# Altium schematic sheet SPE_router_pwr.SchDoc: SPE Router
size 420 x 297 mm; Author: P. Daniel; CompanyName: WUT ISE; DrawnBy: P. Daniel; Organization: WUT ISE; Address1: WUT ISE; Address2: Nowowiejska 15/19 00-665 Warsaw; Address3: piotrmaciejdaniel@gmail.com; Revision: 1; SheetNumber: 2; SheetTotal: 4; ModifiedBy: -; CreateDate: 02-03.2023; CheckedDate: -; Title2: PoE power supply; DivGrp: WUT ISE; Designer: Piotr Daniel
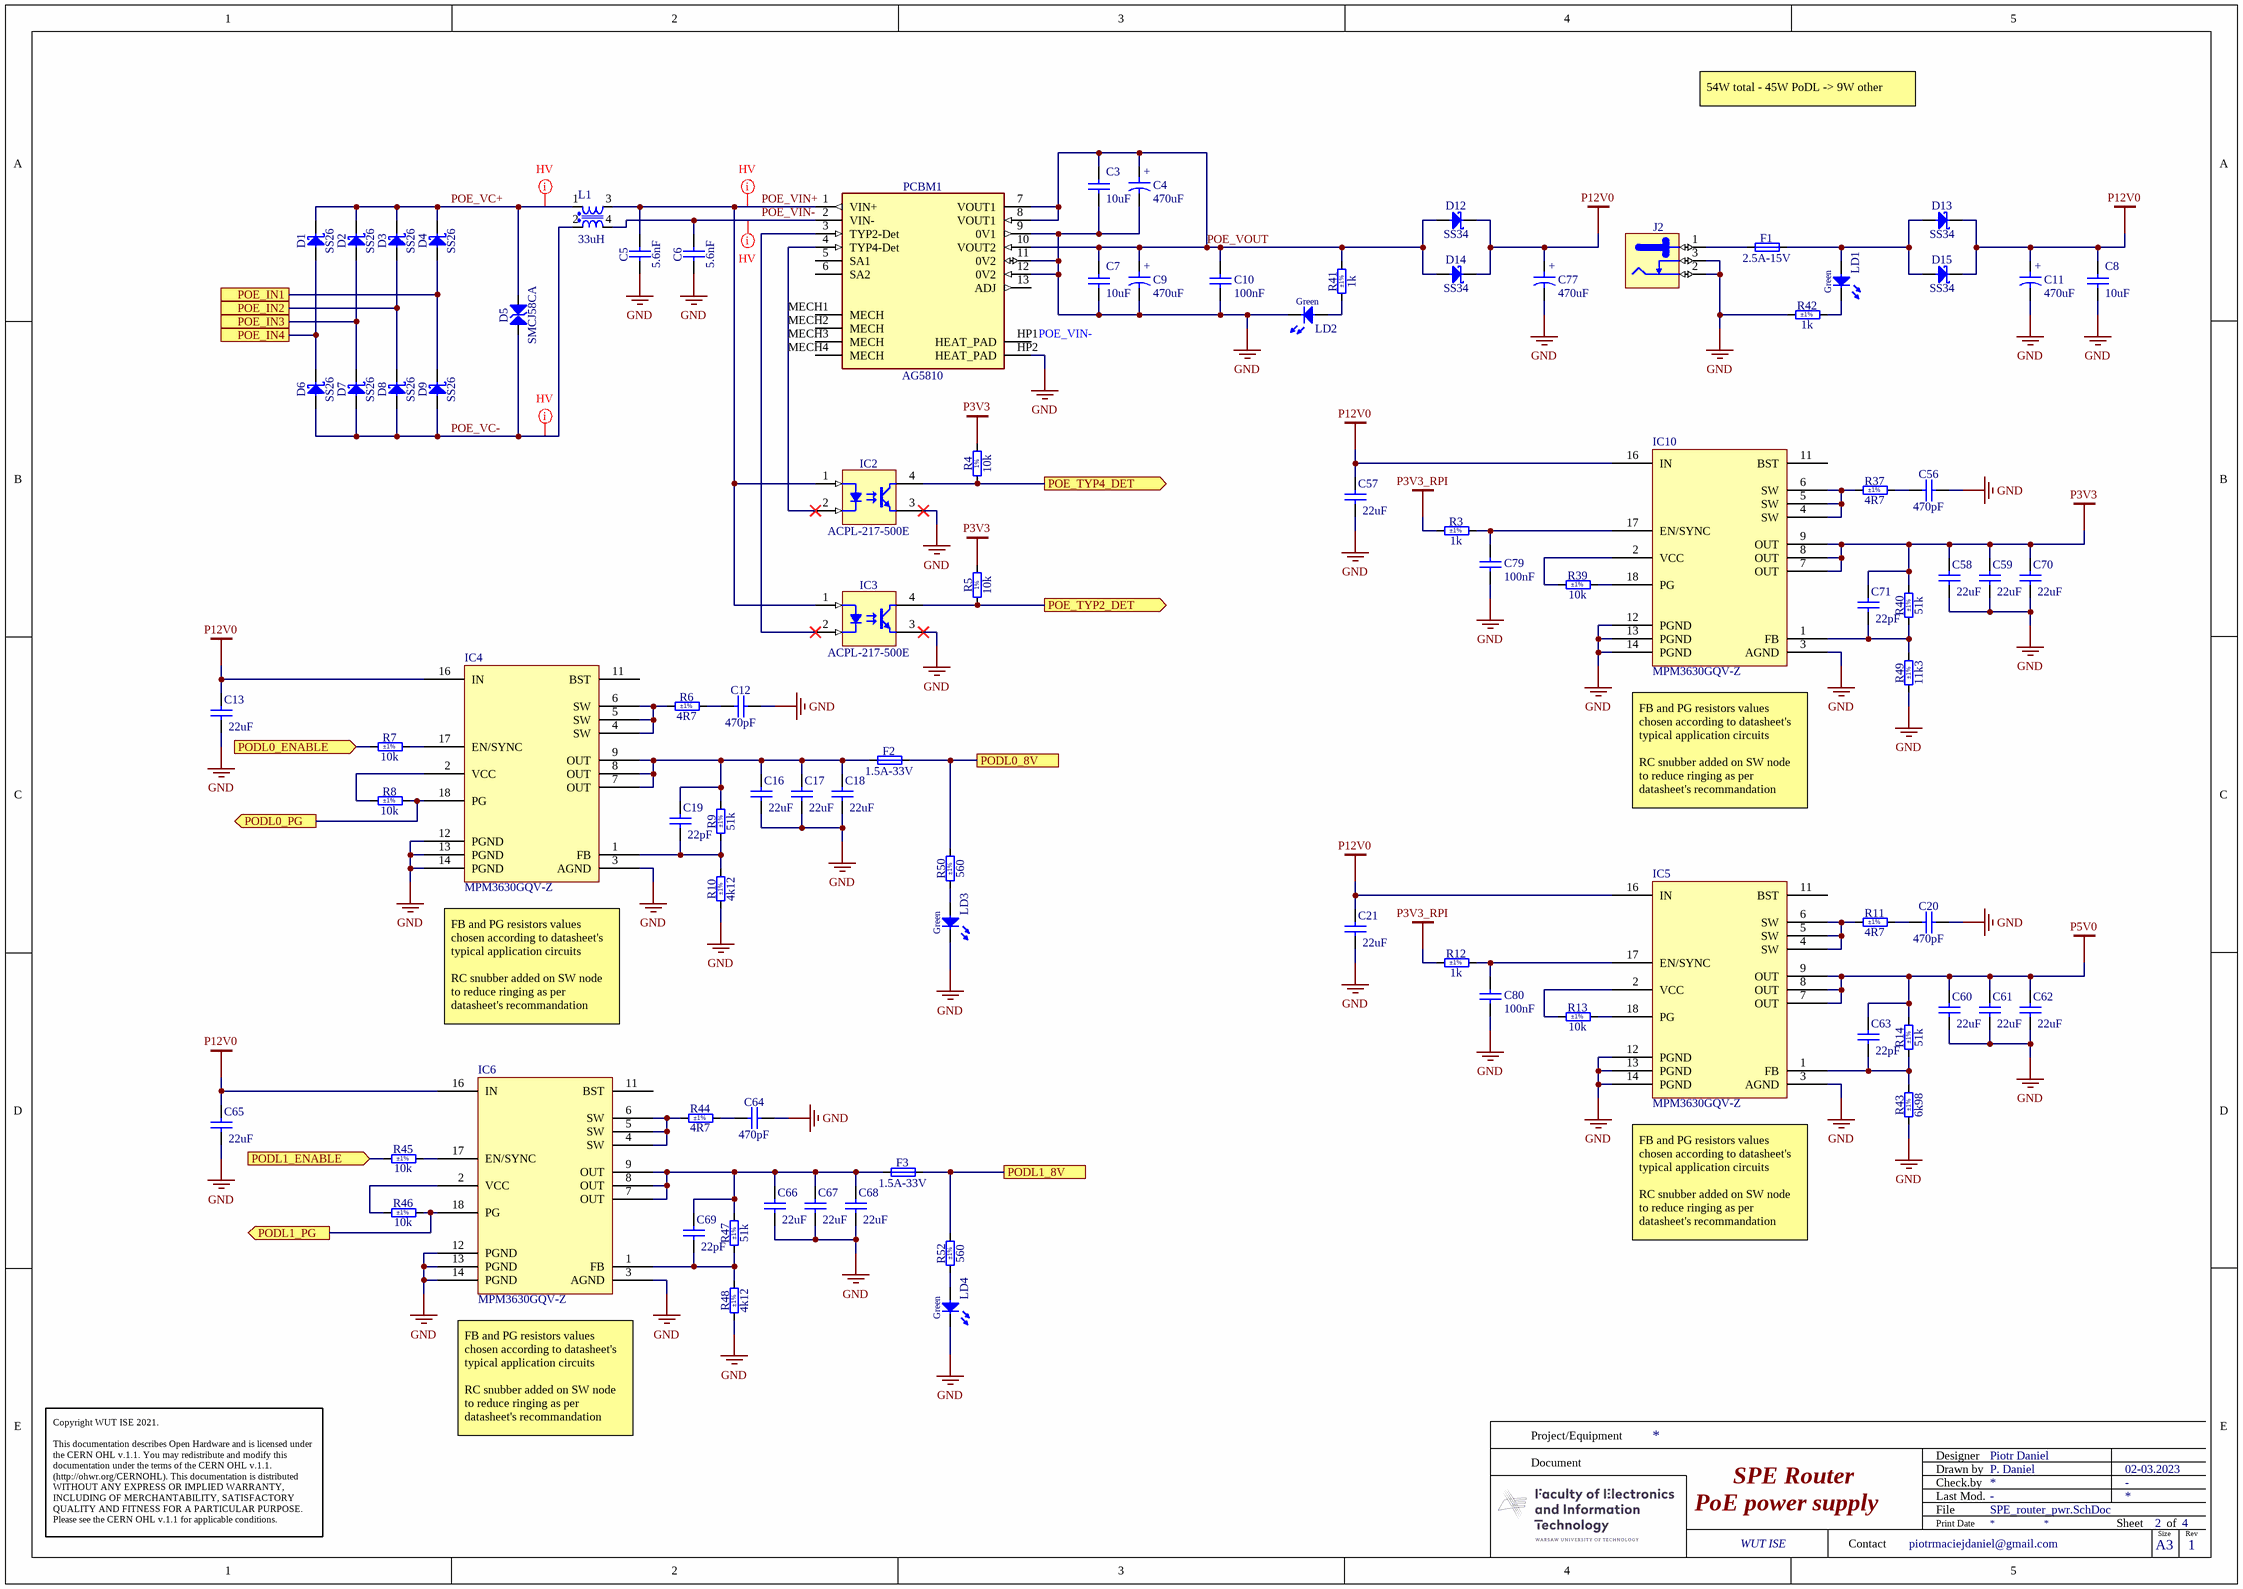
[diagram p0: SPE_router_pwr.SchDoc]

## Parts
C3  10uF  [CAPC3216X180N]
C4  470uF  [CAPAE830X1020N]
C5  5.6nF  [CAPC2220X155N]
C6  5.6nF  [CAPC2220X155N]
C7  10uF  [CAPC3216X180N]
C8  10uF  [CAPC3216X180N]
C9  470uF  [CAPAE830X1020N]
C10  100nF  [CAPC1005X55N]
C11  470uF  [CAPAE830X1020N]
C12  470pF  [CAPC1005X55N]
C13  22uF  [CAPC3225X140N]
C16  22uF  [CAPC3225X140N]
C17  22uF  [CAPC3225X140N]
C18  22uF  [CAPC3225X140N]
C19  22pF  [CAPC1005X55N]
C20  470pF  [CAPC1005X55N]
C21  22uF  [CAPC3225X140N]
C56  470pF  [CAPC1005X55N]
C57  22uF  [CAPC3225X140N]
C58  22uF  [CAPC3225X140N]
C59  22uF  [CAPC3225X140N]
C60  22uF  [CAPC3225X140N]
C61  22uF  [CAPC3225X140N]
C62  22uF  [CAPC3225X140N]
C63  22pF  [CAPC1005X55N]
C64  470pF  [CAPC1005X55N]
C65  22uF  [CAPC3225X140N]
C66  22uF  [CAPC3225X140N]
C67  22uF  [CAPC3225X140N]
C68  22uF  [CAPC3225X140N]
C69  22pF  [CAPC1005X55N]
C70  22uF  [CAPC3225X140N]
C71  22pF  [CAPC1005X55N]
C77  470uF  [CAPAE830X1020N]
C79  100nF  [CAPC1005X55N]
C80  100nF  [CAPC1005X55N]
D1  SS26  [DIOM5336X265N]
D2  SS26  [DIOM5336X265N]
D3  SS26  [DIOM5336X265N]
D4  SS26  [DIOM5336X265N]
D5  SMCJ58CA  [DIOM7959X262N]
D6  SS26  [DIOM5336X265N]
D7  SS26  [DIOM5336X265N]
D8  SS26  [DIOM5336X265N]
D9  SS26  [DIOM5336X265N]
D12  SS34  [DIOM7959X265N]
D13  SS34  [DIOM7959X265N]
D14  SS34  [DIOM7959X265N]
D15  SS34  [DIOM7959X265N]
F1  2.5A-15V  [FUSR_LITTELFUSE_2920L]
F2  1.5A-33V  [FUSR_LITTELFUSE_2920L]
F3  1.5A-33V  [FUSR_LITTELFUSE_2920L]
IC2  ACPL-217-500E  [SOIC127P700X242-4N]
IC3  ACPL-217-500E  [SOIC127P700X242-4N]
IC4  MPM3630GQV-Z  [MPM3610A]
IC5  MPM3630GQV-Z  [MPM3610A]
IC6  MPM3630GQV-Z  [MPM3610A]
IC10  MPM3630GQV-Z  [MPM3610A]
J2  Jack  [SWITCHCRAFT_712RA]  (value not drawn)
L1  33uH  [MSD1278H-333MED]
LD1  Green  [LED_AVAGO_HSME-C110]
LD2  Green  [LED_AVAGO_HSME-C110]
LD3  Green  [LED_AVAGO_HSME-C110]
LD4  Green  [LED_AVAGO_HSME-C110]
PCBM1  AG5810  [PCBM_SILVERTEL_AG5810]
R3  1k  Tolerance: ±1%  [RESC1005X40N]
R4  10k  [RESC1005X40N]
R5  10k  [RESC1005X40N]
R6  4R7  Tolerance: ±1%  [RESC1005X40N]
R7  10k  Tolerance: ±1%  [RESC1005X40N]
R8  10k  Tolerance: ±1%  [RESC1005X40N]
R9  51k  Tolerance: ±1%  [RESC1005X40N]
R10  4k12  Tolerance: ±1%  [RESC1005X40N]
R11  4R7  Tolerance: ±1%  [RESC1005X40N]
R12  1k  Tolerance: ±1%  [RESC1005X40N]
R13  10k  Tolerance: ±1%  [RESC1005X40N]
R14  51k  Tolerance: ±1%  [RESC1005X40N]
R37  4R7  Tolerance: ±1%  [RESC1005X40N]
R39  10k  Tolerance: ±1%  [RESC1005X40N]
R40  51k  Tolerance: ±1%  [RESC1005X40N]
R41  1k  Tolerance: ±1%  [RESC2012X60N]
R42  1k  Tolerance: ±1%  [RESC2012X60N]
R43  6k98  Tolerance: ±1%  [RESC1005X40N]
R44  4R7  Tolerance: ±1%  [RESC1005X40N]
R45  10k  Tolerance: ±1%  [RESC1005X40N]
R46  10k  Tolerance: ±1%  [RESC1005X40N]
R47  51k  Tolerance: ±1%  [RESC1005X40N]
R48  4k12  Tolerance: ±1%  [RESC1005X40N]
R49  11k3  Tolerance: ±1%  [RESC1005X40N]
R50  560  Tolerance: ±1%  [RESC1005X40N]
R52  560  Tolerance: ±1%  [RESC1005X40N]

## Ports
PODL0_8V, PODL0_ENABLE (in), PODL0_PG (out), PODL1_8V, PODL1_ENABLE (in), PODL1_PG (out), POE_IN1, POE_IN2, POE_IN3, POE_IN4, POE_TYP2_DET (out), POE_TYP4_DET (out)

## Nets
GND: C3.1 C4.2 C5.1 C6.1 C7.1 C8.1 C9.2 C10.1 C11.2 C12.2 C13.1 C16.1 C17.1 C18.1 C20.2 C21.1 C56.2 C57.1 C58.1 C59.1 C60.1 C61.1 C62.1 C64.2 C65.1 C66.1 C67.1 C68.1 C70.1 C77.2 C79.1 C80.1 IC2.3(E) IC3.3(E) IC4.3(AGND) IC4.12(PGND) IC4.13(PGND) IC4.14(PGND) IC5.3(AGND) IC5.12(PGND) IC5.13(PGND) IC5.14(PGND) IC6.3(AGND) IC6.12(PGND) IC6.13(PGND) IC6.14(PGND) IC10.3(AGND) IC10.12(PGND) IC10.13(PGND) IC10.14(PGND) J2.2 J2.3 LD2.1(C) LD3.1(C) LD4.1(C) PCBM1.9(0V1) PCBM1.11(0V2) PCBM1.12(0V2) PCBM1.HP2(HEAT_PAD) R10.1 R42.1 R43.1 R48.1 R49.1
P3V3: C58.2 C59.2 C70.2 C71.2 IC10.7(OUT) IC10.8(OUT) IC10.9(OUT) R4.2 R5.2 R40.2
P3V3_RPI: R3.1 R12.1
P5V0: C60.2 C61.2 C62.2 C63.2 IC5.7(OUT) IC5.8(OUT) IC5.9(OUT) R14.2
P12V0: C8.2 C11.1 C13.2 C21.2 C57.2 C65.2 C77.1 D12.1(C) D13.1(C) D14.1(C) D15.1(C) IC4.16(IN) IC5.16(IN) IC6.16(IN) IC10.16(IN)
PODL0_8V: F2.2 R50.2 ; port PODL0_8V
PODL0_ENABLE: R7.1 ; port PODL0_ENABLE
PODL0_PG: IC4.18(PG) R8.2 ; port PODL0_PG
PODL1_8V: F3.2 R52.2 ; port PODL1_8V
PODL1_ENABLE: R45.1 ; port PODL1_ENABLE
PODL1_PG: IC6.18(PG) R46.2 ; port PODL1_PG
POE_IN1: D4.2(A) D9.1(C) ; port POE_IN1
POE_IN2: D3.2(A) D8.1(C) ; port POE_IN2
POE_IN3: D2.2(A) D7.1(C) ; port POE_IN3
POE_IN4: D1.2(A) D6.1(C) ; port POE_IN4
POE_TYP2_DET: IC3.4(C) R5.1 ; port POE_TYP2_DET
POE_TYP4_DET: IC2.4(C) R4.1 ; port POE_TYP4_DET
POE_VC+: D1.1(C) D2.1(C) D3.1(C) D4.1(C) D5.2 L1.1
POE_VC-: D5.1 D6.2(A) D7.2(A) D8.2(A) D9.2(A) L1.2
POE_VIN+: C5.2 IC2.1(A) IC3.1(A) L1.3 PCBM1.1(VIN+)
POE_VIN-: C6.2 L1.4 PCBM1.2(VIN-)
POE_VOUT: C3.2 C4.1 C7.2 C9.1 C10.2 D12.2(A) D14.2(A) PCBM1.7(VOUT1) PCBM1.8(VOUT1) PCBM1.10(VOUT2) R41.2
NetC12_1: C12.1 R6.2
NetC16_2: C16.2 C17.2 C18.2 C19.2 F2.1 IC4.7(OUT) IC4.8(OUT) IC4.9(OUT) R9.2
NetC19_1: C19.1 IC4.1(FB) R9.1 R10.2
NetC20_1: C20.1 R11.2
NetC56_1: C56.1 R37.2
NetC63_1: C63.1 IC5.1(FB) R14.1 R43.2
NetC64_1: C64.1 R44.2
NetC66_2: C66.2 C67.2 C68.2 C69.2 F3.1 IC6.7(OUT) IC6.8(OUT) IC6.9(OUT) R47.2
NetC69_1: C69.1 IC6.1(FB) R47.1 R48.2
NetC71_1: C71.1 IC10.1(FB) R40.1 R49.2
NetC79_2: C79.2 IC10.17(EN/SYNC) R3.2
NetC80_2: C80.2 IC5.17(EN/SYNC) R12.2
NetD13_2: D13.2(A) D15.2(A) F1.2 LD1.2(A)
NetF1_1: F1.1 J2.1
NetIC2_2: IC2.2(C) PCBM1.4(TYP4-Det)
NetIC3_2: IC3.2(C) PCBM1.3(TYP2-Det)
NetIC4_2: IC4.2(VCC) R8.1
NetIC4_4: IC4.4(SW) IC4.5(SW) IC4.6(SW) R6.1
NetIC4_17: IC4.17(EN/SYNC) R7.2
NetIC5_2: IC5.2(VCC) R13.1
NetIC5_4: IC5.4(SW) IC5.5(SW) IC5.6(SW) R11.1
NetIC5_18: IC5.18(PG) R13.2
NetIC6_2: IC6.2(VCC) R46.1
NetIC6_4: IC6.4(SW) IC6.5(SW) IC6.6(SW) R44.1
NetIC6_17: IC6.17(EN/SYNC) R45.2
NetIC10_2: IC10.2(VCC) R39.1
NetIC10_4: IC10.4(SW) IC10.5(SW) IC10.6(SW) R37.1
NetIC10_18: IC10.18(PG) R39.2
NetLD1_1: LD1.1(C) R42.2
NetLD2_2: LD2.2(A) R41.1
NetLD3_2: LD3.2(A) R50.1
NetLD4_2: LD4.2(A) R52.1

Not connected (* = marked no-connect by the designer): IC4 11(BST); IC5 11(BST); IC6 11(BST); IC10 11(BST); PCBM1 5(SA1) 6(SA2) 13(ADJ) HP1(HEAT_PAD) MECH1(MECH) MECH2(MECH) MECH3(MECH) MECH4(MECH)

## Layout directives
net class HV: POE_VC+, POE_VC-, POE_VIN+, POE_VIN-

## Notes on the sheet
- 54W total - 45W PoDL -> 9W other
- POE_VIN-
- (near IC10) FB and PG resistors values chosen according to datasheet's typical application circuits
  RC snubber added on SW node to reduce ringing as per datasheet's recommandation
- (near IC4) FB and PG resistors values chosen according to datasheet's typical application circuits
  RC snubber added on SW node to reduce ringing as per datasheet's recommandation
- (near IC5) FB and PG resistors values chosen according to datasheet's typical application circuits
  RC snubber added on SW node to reduce ringing as per datasheet's recommandation
- (near IC6) FB and PG resistors values chosen according to datasheet's typical application circuits
  RC snubber added on SW node to reduce ringing as per datasheet's recommandation
- Project/Equipment
- Document
- Designer
- Drawn by
- Check.by
- Copyright WUT ISE 2021.
  This documentation describes Open Hardware and is licensed under the CERN OHL v.1.1. You may redistribute and modify this documentation under the terms of the CERN OHL v.1.1. (http://ohwr.org/CERNOHL). This documentation is distributed WITHOUT ANY EXPRESS OR IMPLIED WARRANTY, INCLUDING OF MERCHANTABILITY, SATISFACTORY QUALITY AND FITNESS FOR A PARTICULAR PURPOSE. Please see the CERN OHL v.1.1 for applicable conditions.
- Contact
- File
- Last Mod.
- Print Date
- Sheet
- Size
- A3
- of
- Rev
- (in symbol CAE830-1020_470UF_16V_20%) +
- (in symbol R0402_10K_1%_0.0625W_100PPM) 1%

## Library data of the parts
C3 C7 C8 = CC1206_10UF_25V_10%_X7R: Non-polarised capacitor; Part Description: SMD Multilayer Chip Ceramic Capacitor; Manufacturer: GENERIC; Manufacturer1 Part Number: C1206C106K4RACTU; Voltage: 25V; TC: X7R; Tolerance: ±10%; Part Number: CC1206_10UF_25V_10%_X7R; Component Kind: Standard; Component Type: Standard; Pin Count: 2; Value: 10uF; Status: Preferred; Manufacturer Part Number: CC1206_10UF_25V_10%_X7R; Case: 1206; Mounted: Yes; Socket: No; SMD: Yes; Sense: No; Manufacturer1 Example: KEMET; Manufacturer1 ComponentHeight: 1.8mm; HelpURL: \\cern.ch\dfs\Applications\Altium\Datasheets\CC1206_X7R_KEMET.pdf; Author: CERN DEM JLC; CreateDate: 12.09.2012; LatestRevisionDate: 12.09.2012
C4 C9 C11 C77 = CAE830-1020_470UF_16V_20%: Polarised capacitor; Part Description: Aluminum Electrolytic SMT Capacitor; Manufacturer: PANASONIC; Manufacturer Part Number: EEEFK1C471AP; Voltage: 16V; Tolerance: ±20%; Part Number: CAE830-1020_470UF_16V_20%; Component Kind: Standard; Component Type: Standard; Pin Count: 2; Value: 470uF; Status: Not Recommended; Case: F; Mounted: Yes; Socket: No; SMD: Yes; Sense: No; ComponentHeight: 10.2mm; HelpURL: \\cern.ch\dfs\Applications\Altium\Datasheets\CAE_PANASONIC_FK-V.pdf; Author: CERN DEM JLC; CreateDate: 03.12.2007; LatestRevisionDate: 05.11.2014
C5 C6 = CC2220_5.6NF_3kV_10%_X7R: Non-polarised capacitor; Part Description: High Voltage SMD Multilayer Ceramic Chip Capacitor; Manufacturer: GENERIC; Manufacturer1 Part Number: C2220C562KHRAC; Voltage: 3kV; TC: X7R; Tolerance: ±10%; Part Number: CC2220_5.6NF_3kV_10%_X7R; Component Kind: Standard; Component Type: Standard; Pin Count: 2; Value: 5.6nF; Status: None; Manufacturer Part Number: CC2220_5.6NF_3KV_10%_X7R; Case: 2220; Mounted: Yes; Socket: No; SMD: Yes; Sense: No; Manufacturer1 Example: KEMET; Manufacturer1 ComponentHeight: 1.55mm; HelpURL: \\cern.ch\dfs\Applications\Altium\Datasheets\CC2220_X7R_KEMET_HV_C-SERIES.pdf; Author: CERN DEM WB; CreateDate: 10.03.2022; LatestRevisionDate: 10.03.2022
C10 C79 C80 = CC0402_100NF_16V_10%_X7R: Non-polarised capacitor; Part Description: SMD Multilayer Chip Ceramic Capacitor; Manufacturer: GENERIC; Manufacturer1 Part Number: GRM155R71C104KA88D; Voltage: 16V; TC: X7R; Tolerance: ±10%; Part Number: CC0402_100NF_16V_10%_X7R; Component Kind: Standard; Component Type: Standard; Pin Count: 2; Value: 100nF; Status: Not Recommended; Manufacturer Part Number: CC0402_100NF_16V_10%_X7R; Case: 0402; Mounted: Yes; Socket: No; SMD: Yes; Sense: No; Manufacturer1 Example: MURATA; Manufacturer1 ComponentHeight: 0.55mm; HelpURL: \\cern.ch\dfs\Applications\Altium\Datasheets\CC0402_X7R_MURATA_GRM.pdf; Author: CERN DEM JLC; CreateDate: 05.12.2013; LatestRevisionDate: 03.12.2007
C12 C20 C56 C64 = CC0402_470PF_50V_10%_X7R: Non-polarised capacitor; Part Description: SMD Multilayer Chip Ceramic Capacitor; Manufacturer: GENERIC; Manufacturer1 Part Number: 223858715618; Voltage: 50V; TC: X7R; Tolerance: ±10%; Part Number: CC0402_470PF_50V_10%_X7R; Component Kind: Standard; Component Type: Standard; Pin Count: 2; Value: 470pF; Status: Not Recommended; Manufacturer Part Number: CC0402_470PF_50V_10%_X7R; Case: 0402; Mounted: Yes; Socket: No; SMD: Yes; Sense: No; Manufacturer1 Example: PHYCOMP; Manufacturer1 ComponentHeight: 0.55mm; HelpURL: \\cern.ch\dfs\Applications\Altium\Datasheets\CC0402_NP0_PHYCOMP.pdf; Author: CERN DEM JLC; CreateDate: 03.12.2007; LatestRevisionDate: 03.12.2007
C13 C16-C18 C21 C57-C62 C65-C68 C70 = CC1210_22UF_25V_10%_X7R: Non-polarised capacitor; Part Description: SMD Multilayer Chip Ceramic Capacitor; Manufacturer: GENERIC; Manufacturer1 Part Number: C1210C226K3RAC; Voltage: 25V; TC: X7R; Tolerance: ±10%; Part Number: CC1210_22UF_25V_10%_X7R; Component Kind: Standard; Component Type: Standard; Pin Count: 2; Value: 22uF; Status: None; Manufacturer Part Number: CC1210_22UF_25V_10%_X7R; Case: 1210; Mounted: Yes; Socket: No; SMD: Yes; Sense: No; Manufacturer1 Example: KEMET; Manufacturer1 ComponentHeight: 1.4mm; HelpURL: \\cern.ch\dfs\Applications\Altium\Datasheets\CC1210_X7R_KEMET.pdf; Author: CERN DEM BC; CreateDate: 20.08.2020; LatestRevisionDate: 20.08.2020
C19 C63 C69 C71 = CC0402_22PF_50V_5%_C0G: Non-polarised capacitor; Part Description: SMD Multilayer Chip Ceramic Capacitor; Manufacturer: GENERIC; Manufacturer1 Part Number: C0402C220J5GACTU; Voltage: 50V; TC: C0G/NP0; Tolerance: ±5%; Part Number: CC0402_22PF_50V_5%_C0G; Component Kind: Standard; Component Type: Standard; Pin Count: 2; Value: 22pF; Status: Preferred; Manufacturer Part Number: CC0402_22PF_50V_5%_C0G; Case: 0402; Mounted: Yes; Socket: No; SMD: Yes; Sense: No; Manufacturer1 Example: KEMET; Manufacturer1 ComponentHeight: 0.55mm; HelpURL: \\cern.ch\dfs\Applications\Altium\Datasheets\CC0402_C0G_KEMET_(Commercial Grade).pdf; Author: CERN DEM JLC; CreateDate: 03.12.2007; LatestRevisionDate: 03.12.2007
D1-D4 D6-D9 = SS26: Schottky Diode; Part Description: Schottky Rectifier; Manufacturer: FAIRCHILD SEMICONDUCTOR; Voltage: 60V; Power: 2A; PressFit: No; Bonding: No; Part Number: SS26; Component Kind: Standard; Component Type: Standard; Device: SS26; PackageDescription: DO-214-AA/SMB Diode, Molded Body; 5.34mm L X 3.625mm W X 2.65mm H, IPC Medium Density; Manufacturer Part Number: SS26; Pin Count: 2; Case: DO-214AA; Mounted: Yes; Socket: No; SMD: Yes; Sense: No; ComponentHeight: 2.65mm; HelpURL: \\cern.ch\dfs\Applications\Altium\Datasheets\SS26.pdf; Author: CERN DEM JMW; CreateDate: 10.07.2015; LatestRevisionDate: 10.07.2015
D5 = SMCJ58CA: Transient Voltage Suppressor Diode (Bi-Directional); Part Description: Bi-Directional Transient Voltage Suppressor Diode; Manufacturer: LITTELFUSE; Voltage: 58V; Power: 1500W; PressFit: No; Bonding: No; Part Number: SMCJ58CA; Component Kind: Standard; Component Type: Standard; Device: SMCJ58CA; PackageDescription: DO-214-AB/SMC Molded Diode, Body 7.9x5.9mm, IPC Medium Density; Manufacturer Part Number: SMCJ58CA; Pin Count: 2; Case: DO-214AB; Mounted: Yes; Socket: No; SMD: Yes; Sense: No; ComponentHeight: 2.62mm; HelpURL: \\cern.ch\dfs\Applications\Altium\Datasheets\SMCJ.pdf; Author: CERN DEM HF; CreateDate: 22.07.2022; LatestRevisionDate: 22.07.2022
D12-D15 = SS34: Schottky Diode; Part Description: Surface Mount Schottky Barrier Rectifier; Manufacturer: FAIRCHILD SEMICONDUCTOR; Voltage: 40V; Power: 3A; PressFit: No; Bonding: No; Part Number: SS34; Component Kind: Standard; Component Type: Standard; Device: SS34; PackageDescription: DO-214-AB/SMC Molded Diode, Body 7.95x5.9mm, IPC Medium Density; Manufacturer Part Number: SS34; Pin Count: 2; Case: DO-214AB; Mounted: Yes; Socket: No; SMD: Yes; Sense: No; ComponentHeight: 2.65mm; HelpURL: \\cern.ch\dfs\Applications\Altium\Datasheets\SS34.pdf; Author: CERN DEM JLC; CreateDate: 23.08.2010; LatestRevisionDate: 08.11.2017
F1 = FUSR_LITTELFUSE_2920L250: Fuse; Part Description: POLY-FUSE® Surface Mount Resettable PTC, 2920L Series; PressFit: No; Part Number: FUSR_LITTELFUSE_2920L250; Component Kind: Standard; Component Type: Standard; Pin Count: 2; PackageDescription: Surface Mount POLY-FUSE® Resettable PTC, Body 7.355 x 5.12mm, 2920L Series; Family: Fuses Resettable; Mounted: Yes; Socket: No; SMD: Yes; Sense: No; Value: 2.5A-15V; Manufacturer: LITTELFUSE; Manufacturer Part Number: 2920L250; ComponentHeight: 1.25mm; HelpURL: \\cern.ch\dfs\Applications\Altium\Datasheets\FUSR_LITTELFUSE_2920L.pdf; Author: CERN DEM BC; CreateDate: 05.02.2020; LatestRevisionDate: 05.02.2020
F2 F3 = FUSR_LITTELFUSE_2920L250: Fuse; Part Number: FUSR_LITTELFUSE_2920L150; Part Description: POLY-FUSE® Surface Mount Resettable PTC, 2920L Series; Manufacturer Part Number: 2920L150; PressFit: No; Component Kind: Standard; Component Type: Standard; Pin Count: 2; PackageDescription: Surface Mount POLY-FUSE® Resettable PTC, Body 7.355 x 5.12mm, 2920L Series; Family: Fuses Resettable; Mounted: Yes; Socket: No; SMD: Yes; Sense: No; Value: 1.5A-33V; Manufacturer: LITTELFUSE; ComponentHeight: 1.25mm; HelpURL: \\cern.ch\dfs\Applications\Altium\Datasheets\FUSR_LITTELFUSE_2920L.pdf; Author: CERN DEM BC; CreateDate: 05.02.2020; LatestRevisionDate: 05.02.2020
IC2 IC3 = ACPL-217-500E: Single Optocoupler; Part Description: DC Input, Half-Pitch Phototransistor Optocoupler; Manufacturer: AVAGO TECHNOLOGIES; PressFit: No; Bonding: No; Part Number: ACPL-217-500E; Component Kind: Standard; Component Type: Standard; Device: ACPL-217-500E; PackageDescription: SOIC, 1.27mm, pitch; 4 pin, 2.60mm W X 4.40mm L X 2.42mm H body, IPC Medium Density; Status: Not Recommended; Manufacturer Part Number: ACPL-217-500E; Pin Count: 4; Case: SOIC4; Mounted: Yes; Socket: No; SMD: Yes; Sense: No; ComponentHeight: 2.42mm; HelpURL: \\cern.ch\dfs\Applications\Altium\Datasheets\ACPL-217-500E.pdf; Author: CERN DEM JLC; CreateDate: 11.11.2014; LatestRevisionDate: 11.11.2014
IC4-IC6 IC10 = MPM3630GQV-Z: 18V/3A DC/DC Module Synchronous Step-Down Regulator with Integrated Inductor; Manufacturer: Monolithic Power Systems; Supplier 1: Farnell; Manufacturer Part Number: MPM3630GQV-Z; RoHS: Yes; Category: Board Mount Modules; Stock 1: 4233; Case/Package: QFN; Pins: 18; Series: *; RoHS Compliant: Yes; ComponentLink1URL: http://www.monolithicpower.com/pub/media/document/MPM3630_r1.0.pdf?src-supplier=Digikey; ComponentLink1Description: http://www.monolithicpower.com/pub/media/document/MPM3630_r1.0.pdf?src-supplier=Digikey; ComponentLink2URL: https://www.monolithicpower.com/pub/media/document/MPM3630_r1.0.pdf?src-supplier=Digikey; ComponentLink2Description: https://www.monolithicpower.com/pub/media/document/MPM3630_r1.0.pdf?src-supplier=Digikey; ComponentLink3URL: https://datasheet.octopart.com/MPM3630GQV-Z-Monolithic-Power-Systems-datasheet-140259359.pdf?src-supplier=Newark; ComponentLink3Description: https://datasheet.octopart.com/MPM3630GQV-Z-Monolithic-Power-Systems-datasheet-140259359.pdf?src-supplier=Newark; ComponentLink4URL: https://datasheet.octopart.com/MPM3630GQV-Z-Monolithic-Power-Systems-datasheet-81324618.pdf?src-supplier=Future+Electronics; ComponentLink4Description: https://datasheet.octopart.com/MPM3630GQV-Z-Monolithic-Power-Systems-datasheet-81324618.pdf?src-supplier=Future+Electronics; ComponentLink5URL: https://www.monolithicpower.com/DesktopModules/DocumentManage/API/Document/GetDocument?id=4863&src-supplier=Digikey; ComponentLink5Description: https://www.monolithicpower.com/DesktopModules/DocumentManage/API/Document/GetDocument?id=4863&src-supplier=Digikey; ComponentLink6URL: https://datasheet.octopart.com/MPM3630GQV-Z-Monolithic-Power-Systems-datasheet-155982336.pdf?src-supplier=Monolithic+Power+Systems; ComponentLink6Description: https://datasheet.octopart.com/MPM3630GQV-Z-Monolithic-Power-Systems-datasheet-155982336.pdf?src-supplier=Monolithic+Power+Systems; Supplier Part Number 1: 3358182
J2 = SWITCHCRAFT_712RA: 2.5 mm Center Pin, 5A, 48V, Right Angle, Through Hole, , DC Power Jack Connector; Part Description: 2.5 mm Center Pin, 5A, 48VDC, Right Angle, Through Hole, Locking Power Jack Connector (Threaded Bushings); Manufacturer Part Number: 712RA; PressFit: No; Part Number: SWITCHCRAFT_712RA; Component Kind: Standard; Component Type: Standard; Pin Count: 3; Family: Jack; Mounted: Yes; Socket: No; SMD: No; Sense: No; Status: None; Manufacturer: SWITCHCRAFT; ComponentHeight: 13.8mm; HelpURL: \\cern.ch\dfs\Applications\Altium\Datasheets\SWITCHCRAFT_712RA.pdf; Author: CERN DEM JLC; CreateDate: 19.12.2017; LatestRevisionDate: 19.12.2017
L1 = MSD1278H-333MED: coupled inductor, ferrite core, SMT, RoHS; Manufacturer: Coilcraft; Manufacturer Part Number: MSD1278H-333MED; RoHS: Yes; Category: Inductors; Stock 1: 123; RoHS Compliant: No
LD1-LD4 = LED_AVAGO_HSME-C110: LED Green 1C 2A; Part Description: High Performance Right Angle Chip Green LED; Manufacturer: AVAGO TECHNOLOGIES; PressFit: No; Bonding: No; Part Number: LED_AVAGO_HSME-C110; Component Kind: Standard; Component Type: Standard; Color: Green; PackageDescription: Green Chip LED, 2-Leads, Body 3.3x1.6mm, Side Emitting Package; Manufacturer Part Number: HSME-C110; Pin Count: 2; Case: 1206; Mounted: Yes; Socket: No; SMD: Yes; Sense: No; ComponentHeight: 1.1mm; HelpURL: \\cern.ch\dfs\Applications\Altium\Datasheets\LED_AVAGO_HSME-C110.pdf; ComponentLink1URL: \\cern.ch\dfs\Applications\Altium\Datasheets\LED_AVAGO_HSME-C110_DESIGN-GUIDE.pdf; ComponentLink1Description: Design Guide; Author: CERN DEM JMW; CreateDate: 30.07.2009; LatestRevisionDate: 20.06.2012
PCBM1 = PCBM_SILVERTEL_AG5810: 60W IEEE802.3bt Type 4 Power Over Ethernet Module; PressFit: No; Bonding: No; Part Number: PCBM_SILVERTEL_AG5810; Component Kind: Standard; Component Type: Standard; Device: AG5810; PackageDescription: 60W IEEE802.3bt PD Module; 70mm W X 30.0mm L X 15.64mm H body; Part Description: 60W IEEE802.3bt Type 4 Power Over Ethernet Module; Manufacturer: SILVERTEL; Manufacturer Part Number: AG5810; Pin Count: 13; Mounted: Yes; Socket: No; SMD: No; Sense: No; ComponentHeight: 15.64mm; Author: CERN DEM BC; HelpURL: \\cern.ch\dfs\Applications\Altium\Datasheets\PCBM_SILVERTEL_AG5810.pdf; CreateDate: 10.03.2021; LatestRevisionDate: 10.03.2021
R3 R12 = R0402_1K_1%_0.0625W_100PPM: Resistor - 1%; Part Description: General Purpose Thick Film Chip Resistor; Manufacturer: GENERIC; Manufacturer1 Part Number: 232270671002L; TC: ±100ppm/°C; PressFit: No; Part Number: R0402_1K_1%_0.0625W_100PPM; Component Kind: Standard; Component Type: Standard; Pin Count: 2; Value: 1k; Status: Not Recommended; Power: 0.0625W; Manufacturer Part Number: R0402_1K_1%_0.0625W_100PPM; Case: 0402; Mounted: Yes; Sense: No; Socket: No; SMD: Yes; Manufacturer1 Example: YAGEO PHYCOMP; Manufacturer1 ComponentHeight: 0.4mm; HelpURL: \\cern.ch\dfs\Applications\Altium\Datasheets\R0402_Phycomp_RC0402.pdf; Author: CERN DEM JLC; CreateDate: 03.12.2007; LatestRevisionDate: 17.10.2012
R4 R5 R7 R8 R13 R39 R45 R46 = R0402_10K_1%_0.0625W_100PPM: Resistor - 1%; Part Description: General Purpose Thick Film Chip Resistor; Manufacturer: GENERIC; Manufacturer1 Part Number: 232270671003L; TC: ±100ppm/°C; PressFit: No; Part Number: R0402_10K_1%_0.0625W_100PPM; Component Kind: Standard; Component Type: Standard; Pin Count: 2; Value: 10k; Status: Not Recommended; Power: 0.0625W; Manufacturer Part Number: R0402_10K_1%_0.0625W_100PPM; Case: 0402; Mounted: Yes; Sense: No; Socket: No; SMD: Yes; Manufacturer1 Example: YAGEO PHYCOMP; Manufacturer1 ComponentHeight: 0.4mm; HelpURL: \\cern.ch\dfs\Applications\Altium\Datasheets\R0402_Phycomp_RC0402.pdf; Author: CERN DEM JLC; CreateDate: 03.12.2007; LatestRevisionDate: 17.10.2012
  R4 R5: Tolerance: ±1%
R6 R11 R37 R44 = R0402_4R7_1%_0.0625W_200PPM: Resistor - 1%; Part Description: General Purpose Thick Film Chip Resistor; Manufacturer: GENERIC; Manufacturer1 Part Number: 232270674708L; TC: ±200ppm/°C; PressFit: No; Part Number: R0402_4R7_1%_0.0625W_200PPM; Component Kind: Standard; Component Type: Standard; Pin Count: 2; Value: 4R7; Status: Not Recommended; Power: 0.0625W; Manufacturer Part Number: R0402_4R7_1%_0.0625W_200PPM; Case: 0402; Mounted: Yes; Sense: No; Socket: No; SMD: Yes; Manufacturer1 Example: YAGEO PHYCOMP; Manufacturer1 ComponentHeight: 0.4mm; HelpURL: \\cern.ch\dfs\Applications\Altium\Datasheets\R0402_Phycomp_RC0402.pdf; Author: CERN DEM JLC; CreateDate: 03.12.2007; LatestRevisionDate: 17.10.2012
R9 R14 R40 R47 = R0402_51K_1%_0.0625W_100PPM: Resistor - 1%; Part Description: General Purpose Thick Film Chip Resistor; Manufacturer: GENERIC; Manufacturer1 Part Number: 232270675103L; TC: ±100ppm/°C; PressFit: No; Part Number: R0402_51K_1%_0.0625W_100PPM; Component Kind: Standard; Component Type: Standard; Pin Count: 2; Value: 51k; Status: Not Recommended; Power: 0.0625W; Manufacturer Part Number: R0402_51K_1%_0.0625W_100PPM; Case: 0402; Mounted: Yes; Sense: No; Socket: No; SMD: Yes; Manufacturer1 Example: YAGEO PHYCOMP; Manufacturer1 ComponentHeight: 0.4mm; HelpURL: \\cern.ch\dfs\Applications\Altium\Datasheets\R0402_Phycomp_RC0402.pdf; Author: CERN DEM JLC; CreateDate: 03.12.2007; LatestRevisionDate: 17.10.2012
R10 R48 = R0402_4K12_1%_0.0625W_100PPM: Resistor - 1%; Part Description: General Purpose Thick Film Chip Resistor; Manufacturer: GENERIC; Manufacturer1 Part Number: 232270674122L or RC0402FR-074K12L; TC: ±100ppm/°C; PressFit: No; Part Number: R0402_4K12_1%_0.0625W_100PPM; Component Kind: Standard; Component Type: Standard; Pin Count: 2; Value: 4k12; Status: Not Recommended; Power: 0.0625W; Manufacturer Part Number: R0402_4K12_1%_0.0625W_100PPM; Case: 0402; Mounted: Yes; Sense: No; Socket: No; SMD: Yes; Manufacturer1 Example: YAGEO PHYCOMP; Manufacturer1 ComponentHeight: 0.4mm; HelpURL: \\cern.ch\dfs\Applications\Altium\Datasheets\R0402_Phycomp_RC0402.pdf; Author: CERN DEM JLC; CreateDate: 24.10.2012; LatestRevisionDate: 24.10.2012
R41 R42 = R0805_1K_1%_0.125W_100PPM: Resistor - 1%; Part Description: General Purpose Thick Film Chip Resistor; Manufacturer: GENERIC; Manufacturer1 Part Number: NRC10F1001TRF; Power: 0.125W; TC: ±100ppm/°C; PressFit: No; Part Number: R0805_1K_1%_0.125W_100PPM; Component Kind: Standard; Component Type: Standard; Pin Count: 2; Value: 1k; Status: Preferred; Manufacturer Part Number: R0805_1K_1%_0.125W_100PPM; Case: 0805; Mounted: Yes; Sense: No; Socket: No; SMD: Yes; Manufacturer1 Example: NIC COMPONENT; Manufacturer1 ComponentHeight: 0.6mm; HelpURL: \\cern.ch\dfs\Applications\Altium\Datasheets\R0805_NIC_NRC.pdf; Author: CERN DEM JLC; CreateDate: 03.12.2007; LatestRevisionDate: 13.03.2008
R43 = R0402_51K_1%_0.0625W_100PPM: Resistor - 1%; Part Number: R0402_6K98_1%_0.0625W_100PPM; Part Description: General Purpose Thick Film Chip Resistor; Manufacturer: GENERIC; TC: ±100ppm/°C; PressFit: No; Component Kind: Standard; Component Type: Standard; Pin Count: 2; Value: 6k98; Status: Not Recommended; Power: 0.0625W; Manufacturer Part Number: R0402_6K98_1%_0.0625W_100PPM; Case: 0402; Mounted: Yes; Sense: No; Socket: No; SMD: Yes; Manufacturer1 ComponentHeight: 0.4mm; HelpURL: \\cern.ch\dfs\Applications\Altium\Datasheets\R0402_Phycomp_RC0402.pdf; Author: CERN DEM JLC; CreateDate: 03.12.2007; LatestRevisionDate: 17.10.2012
R49 = R0402_11K_1%_0.0625W_100PPM: Resistor - 1%; Part Number: R0402_11K3_1%_0.0625W_100PPM; Part Description: General Purpose Thick Film Chip Resistor; Manufacturer: GENERIC; TC: ±100ppm/°C; PressFit: No; Component Kind: Standard; Component Type: Standard; Pin Count: 2; Value: 11k3; Status: Not Recommended; Power: 0.0625W; Manufacturer Part Number: R0402_11K3_1%_0.0625W_100PPM; Case: 0402; Mounted: Yes; Sense: No; Socket: No; SMD: Yes; Manufacturer1 ComponentHeight: 0.4mm; HelpURL: \\cern.ch\dfs\Applications\Altium\Datasheets\R0402_Phycomp_RC0402.pdf; Author: CERN DEM JLC; CreateDate: 03.12.2007; LatestRevisionDate: 17.10.2012
R50 R52 = R0402_560R_1%_0.0625W_100PPM: Resistor - 1%; Part Description: General Purpose Thick Film Chip Resistor; Manufacturer: GENERIC; Manufacturer1 Part Number: 232270675601L; TC: ±100ppm/°C; PressFit: No; Part Number: R0402_560R_1%_0.0625W_100PPM; Component Kind: Standard; Component Type: Standard; Pin Count: 2; Value: 560; Status: Not Recommended; Power: 0.0625W; Manufacturer Part Number: R0402_560R_1%_0.0625W_100PPM; Case: 0402; Mounted: Yes; Sense: No; Socket: No; SMD: Yes; Manufacturer1 Example: YAGEO PHYCOMP; Manufacturer1 ComponentHeight: 0.4mm; HelpURL: \\cern.ch\dfs\Applications\Altium\Datasheets\R0402_Phycomp_RC0402.pdf; Author: CERN DEM JLC; CreateDate: 03.12.2007; LatestRevisionDate: 17.10.2012